# EAGLE design JACKET_NEW_TESTING_BOARD_12-7-18 (EAGLE 9.2.2)
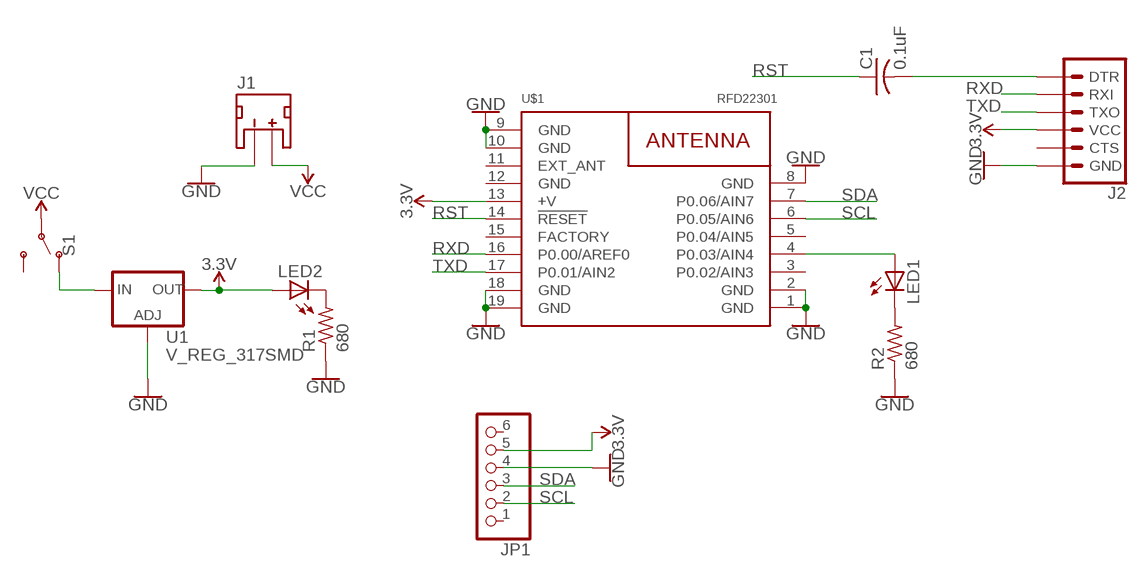
[diagram p0: schematic, sheet 1]

## Parts
C1  0.1uF  C-USC0805  [C0805]
J1  JST_2MM_MALE  [JST-2-SMD]
J2  6_PIN_SERIAL_TARGET  [1X06]
JP1  PINHD-1X6CB  [1X06-CLEANBIG]
LED1  LEDCHIP-LED0805  [CHIP-LED0805]
LED2  LEDCHIP-LED0805  [CHIP-LED0805]
R1  680  R-US_R0805  [R0805]
R2  680  R-US_R0805  [R0805]
S1  SWITCH-SPDT-PTH-11.6X4.0MM  [SWITCH_SPDT_PTH_11.6X4.0MM]
U1  V_REG_317SMD  [SOT223]
U$1  RFD22301  [RFD22301]

## Nets
3.3V: J2.4(VCC) JP1.5 LED2.A U1.2(OUT) U$1.13(+V)
GND: J1.1(-) J2.6(GND) JP1.4 R1.1 R2.1 U1.1(ADJ) U$1.1(GND) U$1.2(GND) U$1.8(GND) U$1.9(GND) U$1.10(GND) U$1.18(GND) U$1.19(GND)
N$1: S1.1(O) U1.3(IN)
N$2: LED2.C R1.2
N$3: LED1.C R2.2
N$4: LED1.A U$1.4(P0.03/AIN4)
N$8: C1.2 J2.1(DTR)
RST: C1.1 U$1.14(!RESET!)
RXD: J2.2(RXI) U$1.16(P0.00/AREF0)
SCL: JP1.2 U$1.6(P0.05/AIN6)
SDA: JP1.3 U$1.7(P0.06/AIN7)
TXD: J2.3(TXO) U$1.17(P0.01/AIN2)
VCC: J1.2(+) S1.2(P)
Unconnected: J1.NC1(PAD1) J1.NC2(PAD2) J2.5(CTS) JP1.1 JP1.6 S1.3(S) U$1.3(P0.02/AIN3) U$1.5(P0.04/AIN5) U$1.11(EXT_ANT) U$1.15(FACTORY)

## Power pins joined to a net without a drawn wire
GND: U$1.12(GND)

## Library data of the parts
C1 = adafruit:C-US: CAPACITOR, American symbol
J1 = SparkFun-Connectors:JST_2MM_MALE: JST 2MM MALE RA CONNECTOR Two pin, compact surface mount connector. Commonly used as a battery input connection point. We really like the solid locking feeling and high current rating on these small connectors. We use these all the time as battery connectors. Mates to single-cell LiPo batteries. Here is the connector we sell at SparkFun: JST Right Angle Connector - White <https://www.sparkfun.com/products/8612> (PRT-08612) Datasheet <http://www.sparkfun.com/datasheets/Prototyping/Connectors/JST-Horizontal.pdf> It was used on these SparkFun products: SparkFun MOSFET Power Controller <https://www.sparkfun.com/products/11214> (PRT-11214) SparkFun Battery Babysitter - LiPo Battery Manager <https://www.sparkfun.com/products/13777> (PRT-13777) And many, many others that required a lipo battery connection.; PROD_ID: CONN-11443; SF_ID: PRT-08612
J2 = SparkFun-Connectors:6_PIN_SERIAL_TARGET: 6-pin header connection for use with the "FTDI BASIC" pinout - TARGET SIDE. Also known as "Arduino Serial Program Header". It is used to mate with our FTDI Basic serial programmers using the Arduino IDE. Note, this device has "TARGET" in the name. It is intended to be used on a design that contains a target micro-controller that you wish to program. The "sister" device, named "CABLE" is inteneded to be used on a design that usually lives on the end of your USB cable and prvides the converter chip (FTDI232 or FTDI231x) to commnicate serial RX/TX. You can populate with some of these: Break Away Headers - Straight <https://www.sparkfun.com/products/116> (PRT-00116) For reference (or to suit your programming needs) check out these designs: SparkFun FTDI Basic Breakout - 5V <https://www.sparkfun.com/products/9716> (DEV-09716) SparkFun FTDI Basic Breakout - 3.3V <https://www.sparkfun.com/products/9873> (DEV-09873) SparkFun FTDI SmartBasic <https://www.sparkfun.com/products/12935> (DEV-12935) SparkFun Beefy 3 - FTDI Basic Breakout <https://www.sparkfun.com/products/13746> (DEV-13746)
JP1 = adafruit:PINHD-1X6: PIN HEADER
LED1 LED2 = adafruit:LED: LED OSRAM: - CHIPLED LG R971, LG N971, LY N971, LG Q971, LY Q971, LO R971, LY R971 LH N974, LH R974 LS Q976, LO Q976, LY Q976 LO Q996 - Hyper CHIPLED LW Q18S LB Q993, LB Q99A, LB R99A - SideLED LS A670, LO A670, LY A670, LG A670, LP A670 LB A673, LV A673, LT A673, LW A673 LH A674 LY A675 LS A676, LA A676, LO A676, LY A676, LW A676 LS A679, LY A679, LG A679 - Hyper Micro SIDELED® LS Y876, LA Y876, LO Y876, LY Y876 LT Y87S - SmartLED LW L88C, LW L88S LB L89C, LB L89S, LG L890 LS L89K, LO L89K, LY L89K LS L896, LA L896, LO L896, LY L896 - TOPLED LS T670, LO T670, LY T670, LG T670, LP T670 LSG T670, LSP T670, LSY T670, LOP T670, LYG T670 LG T671, LOG T671, LSG T671 LB T673, LV T673, LT T673, LW T673 LH T674 LS T676, LA T676, LO T676, LY T676, LB T676, LH T676, LSB T676, LW T676 LB T67C, LV T67C, LT T67C, LS T67K, LO T67K, LY T67K, LW E67C LS E67B, LA E67B, LO E67B, LY E67B, LB E67C, LV E67C, LT E67C LW T67C LS T679, LY T679, LG T679 LS T770, LO T770, LY T770, LG T770, LP T770 LB T773, LV T773, LT T773, LW T773 LH T774 LS E675, LA E675, LY E675, LS T675 LS T776, LA T776, LO T776, LY T776, LB T776 LHGB T686 LT T68C, LB T68C - Hyper Mini TOPLED® LB M676 - Mini TOPLED Santana® LG M470 LS M47K, LO M47K, LY M47K Source: http://www.osram.convergy.de/
R1 R2 = resistor:R-US_: RESISTOR, American symbol
S1 = SparkFun-Switches:SWITCH-SPDT: Single Pole, Double Throw (SPDT) Switch Single-pole, double-throw (SPDT) switch. Variant Overview SMD-AYZ0202 Surface Mount DPDT Switch <https://www.sparkfun.com/products/597> (COM-00597) Used on e.g. LilyPad Arduino USB - ATmega32U4 Board <https://www.sparkfun.com/products/12049> PTH-11.6X4.0MM SPDT Mini Power Switch <https://www.sparkfun.com/products/102> (COM-00102) Used on e.g. SparkFun Simon Says - Through-Hole Soldering Kit <https://www.sparkfun.com/products/10547> (KIT-10547) PTH-11.6X4.0MM-KIT KIT version of SPDT Mini Power Switch - Simplifies soldering by removing tStop of switch pins - only one side can be soldered. PTH-11.6X4.0MM-LOCK LOCK version of SPDT Mini Power Switch - Offset pins hold switch in place for easier soldering. SMD-RIGHT-ANGLE Surface Mount Right Angle Switch <https://www.sparkfun.com/products/10860> (COM-10860) Used on e.g. SparkFun ESP8266 Thing <https://www.sparkfun.com/products/13231>; PROD_ID: SWCH-08261; SF_SKU: COM-00102
U1 = SparkFun-IC-Power:V_REG_317: Voltage Regulator Standard LM317 adjustable voltage regulator. AOI (Adjust Output Input). Google 'LM317 Calculator' for easy to use app to get the two resistor values needed. 240/720 for 5V output. 240/390 for 3.3V output. Spark Fun Electronics SKU : COM-00527
U$1 = RFDigital:RFD22301: Bluetooth 4.0 Low Energy BLE RF Module RFD22301 With Built-In ARM Cortex M0 Microcontroller © 2013 RF Digital Corporation www.RFDigital.com

## Net classes
0 default: width 0.508 mm, drill 0.762 mm, clearance 0.508 mm

## Board
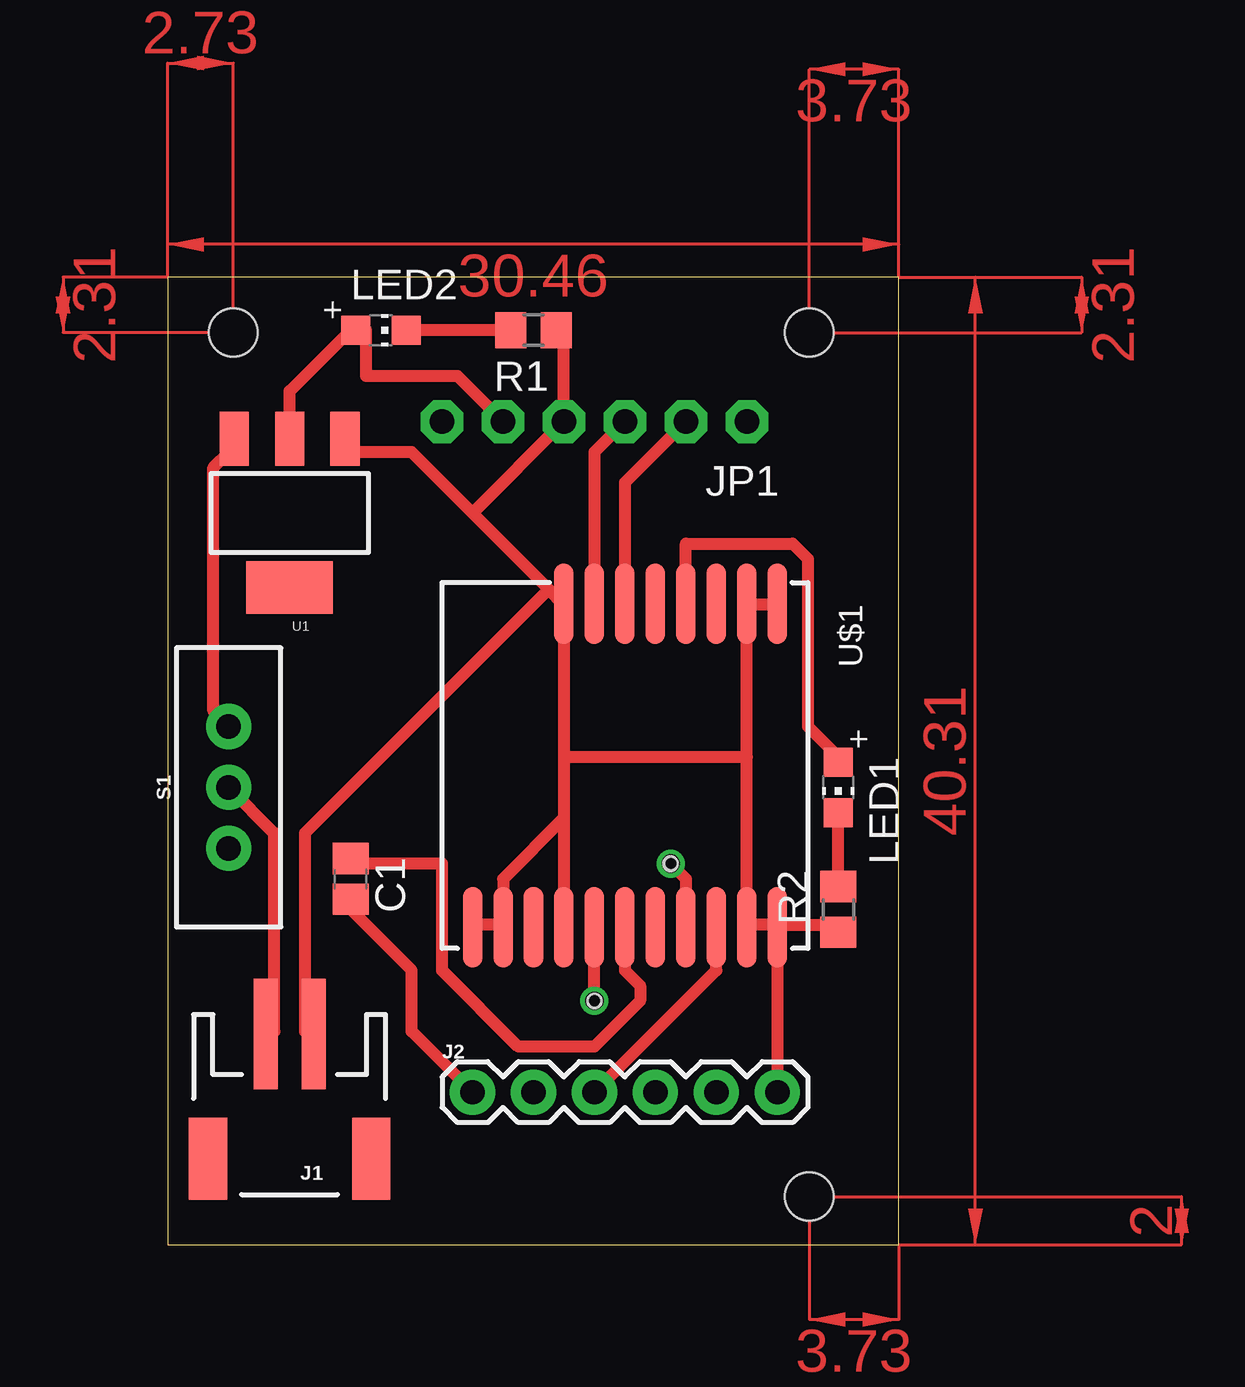
[diagram p1: board, top side]
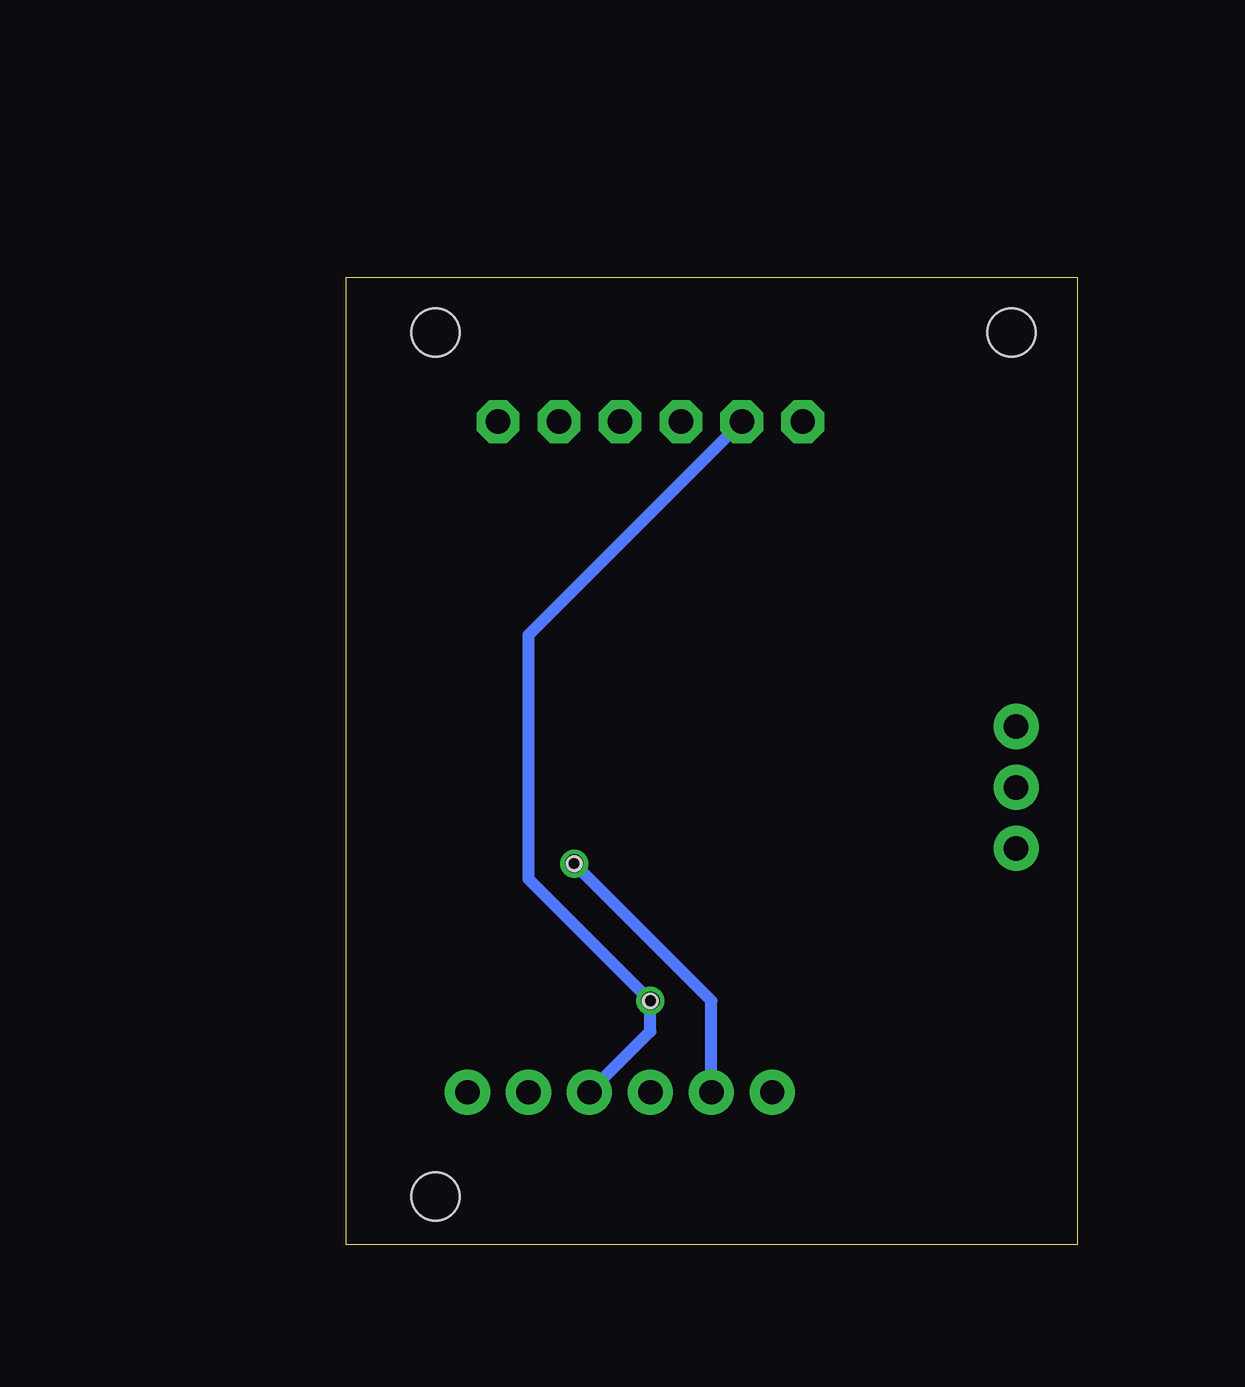
[diagram p2: board, bottom side, seen from below]

Size 30.46 x 40.31 mm. Coordinates in mm from the lower left corner, seen from the top.
Outline: 0,0 30.46,0 30.46,40.31 0,40.31 0,0
Copper layers (1*16): Top 0.035mm / dielectric 1.5mm / Bottom 0.035mm
Design rules "default": minimum track width 6mil, minimum drill 0.35mm, track to track 6mil, track to pad 6mil, pad to pad 6mil, via to via 6mil, smd to smd 6mil, copper to edge 40mil, drill to drill 6mil, minimum pad ring 10mil, minimum via ring 8mil, stop-mask expansion 4mil, vias tented up to drill 0mil, thermal gap 10mil
Holes 0.55 mm at 17.78,10.16 20.97,15.88
Holes 0.6 mm at 17.78,10.15 20.95,15.87
Holes 2.01 mm at 2.73,38 26.73,38 26.73,2

### Footprints (pad centres in the part's own frame; a part is rotated, then mirrored left to right if it is on the bottom)
C0805 = smd 1.3 x 1.5: 1 -0.85,0; 2 0.85,0
JST-2-SMD = smd 1 x 4.6: 1 -1,-3.7; 2 1,-3.7 | smd 1.6 x 3.4: NC1 -3.4,1.5; NC2 3.4,1.5
1X06 = drill 1.016 pad 1.88: 1 0,0; 2 2.54,0; 3 5.08,0; 4 7.62,0; 5 10.16,0; 6 12.7,0
1X06-CLEANBIG = drill 1.016 pad 1.778 octagon: 1 -6.35,0; 2 -3.81,0; 3 -1.27,0; 4 1.27,0; 5 3.81,0; 6 6.35,0
CHIP-LED0805 = smd 1.2 x 1.2: A 0,-1.05; C 0,1.05
R0805 = smd 1.3 x 1.5: 1 -0.95,0; 2 0.95,0
SWITCH_SPDT_PTH_11.6X4.0MM = drill 1.016 pad 1.88: 1 0,2.54; 2 0,0; 3 0,-2.54
SOT223 = smd 1.219 x 2.235: 1 -2.311,-3.099; 2 0,-3.099; 3 2.311,-3.099 | smd 3.6 x 2.2: 4 0,3.099
RFD22301 = smd 3.353 x 0.813: 1 -6.375,5.08; 2 -6.375,3.81; 3 -6.375,2.54; 4 -6.375,1.27; 5 -6.375,0; 6 -6.375,-1.27; 7 -6.375,-2.54; 8 -6.375,-3.81; 9 7.087,-7.62; 10 7.087,-6.35; 11 7.087,-5.08; 12 7.087,-3.81; 13 7.087,-2.54; 14 7.087,-1.27; 15 7.087,0; 16 7.087,1.27; 17 7.087,2.54; 18 7.087,3.81; 19 7.087,5.08

### Placement (x,y rotation side)
C1  7.62,15.24 270 top
J1  5.08,5.08 180 top
J2  12.7,6.35 0 top
JP1  17.78,34.29 180 top
LED1  27.94,19.05 180 top
LED2  8.89,38.1 270 top
R1  15.24,38.1 180 top
R2  27.94,13.97 90 top
S1  2.54,19.05 0 top
U1  5.08,30.48 180 top
U$1  20.32,20.32 270 top

### Tracks (layer width: path | path; a pad name or v marks a point on that pad's centre or on a via)
3.3V  (via drill 0.76)
  Top 0.508: v17.78,10.16 U$1.13 | U1.2 5.08,35.56 7.62,38.1 LED2.A 8.26,38.1 8.26,36.2 12.07,36.2 JP1.5
  Bottom 0.508: J2.4 17.78,8.89 v17.78,10.16 22.86,15.24 22.86,25.4 JP1.5
GND
  Top 0.508: 24.13,26.67 25.4,26.67 U$1.1 | 25.4,13.34 27.94,13.34 R2.1 | 25.4,13.34 24.13,13.34 | 25.4,13.34 U$1.19 J2.6 | 24.13,13.34 24.13,20.32 | 24.13,20.32 24.13,26.67 | 24.13,26.67 U$1.2 | 24.13,13.34 U$1.18 | R1.1 16.51,38.1 JP1.4 12.7,30.48 | 13.97,13.34 12.7,13.34 U$1.9 | 16.51,26.67 15.88,27.3 | 15.88,27.3 12.7,30.48 | 12.7,30.48 10.16,33.02 7.62,33.02 U1.1 | 16.51,26.67 16.51,20.32 | 16.51,20.32 16.51,17.78 | 16.51,17.78 U$1.12 | 16.51,26.67 U$1.8 | 13.97,13.34 13.97,15.24 16.51,17.78 | 13.97,13.34 U$1.10 | 15.88,27.3 5.71,17.14 5.71,8.89 J1.1 | 16.51,20.32 24.13,20.32
N$1
  Top 0.508: S1.1 1.9,22.23 1.9,32.38 2.54,33.02 U1.3
N$2
  Top 0.508: R1.2 LED2.C
N$3
  Top 0.508: R2.2 LED1.C
N$4
  Top 0.508: U$1.4 21.59,29.21 26.04,29.21 26.67,28.57 26.67,21.59 27.94,20.32 LED1.A
N$8
  Top 0.508: J2.1 10.16,8.89 10.16,11.43 7.62,13.97 C1.2
RST
  Top 0.508: U$1.14 19.05,11.43 19.68,10.79 19.68,10.16 17.78,8.26 14.61,8.26 11.43,11.43 11.43,15.88 7.62,15.88 C1.1
RXD  (via drill 0.76)
  Top 0.508: U$1.16 21.59,15.24 v20.96,15.88
  Bottom 0.508: v20.96,15.88 15.24,10.16 J2.2
SCL
  Top 0.508: U$1.6 19.05,31.75 JP1.2
SDA
  Top 0.508: U$1.7 17.78,33.02 JP1.3
TXD
  Top 0.508: U$1.17 22.86,11.43 J2.3
VCC
  Top 0.508: S1.2 4.45,17.14 4.45,8.89 J1.2
(copper drawn outside any net)
  shapes: Top area x8